# EAGLE design Servos & Aux Motors Board (EAGLE 6.5.0)
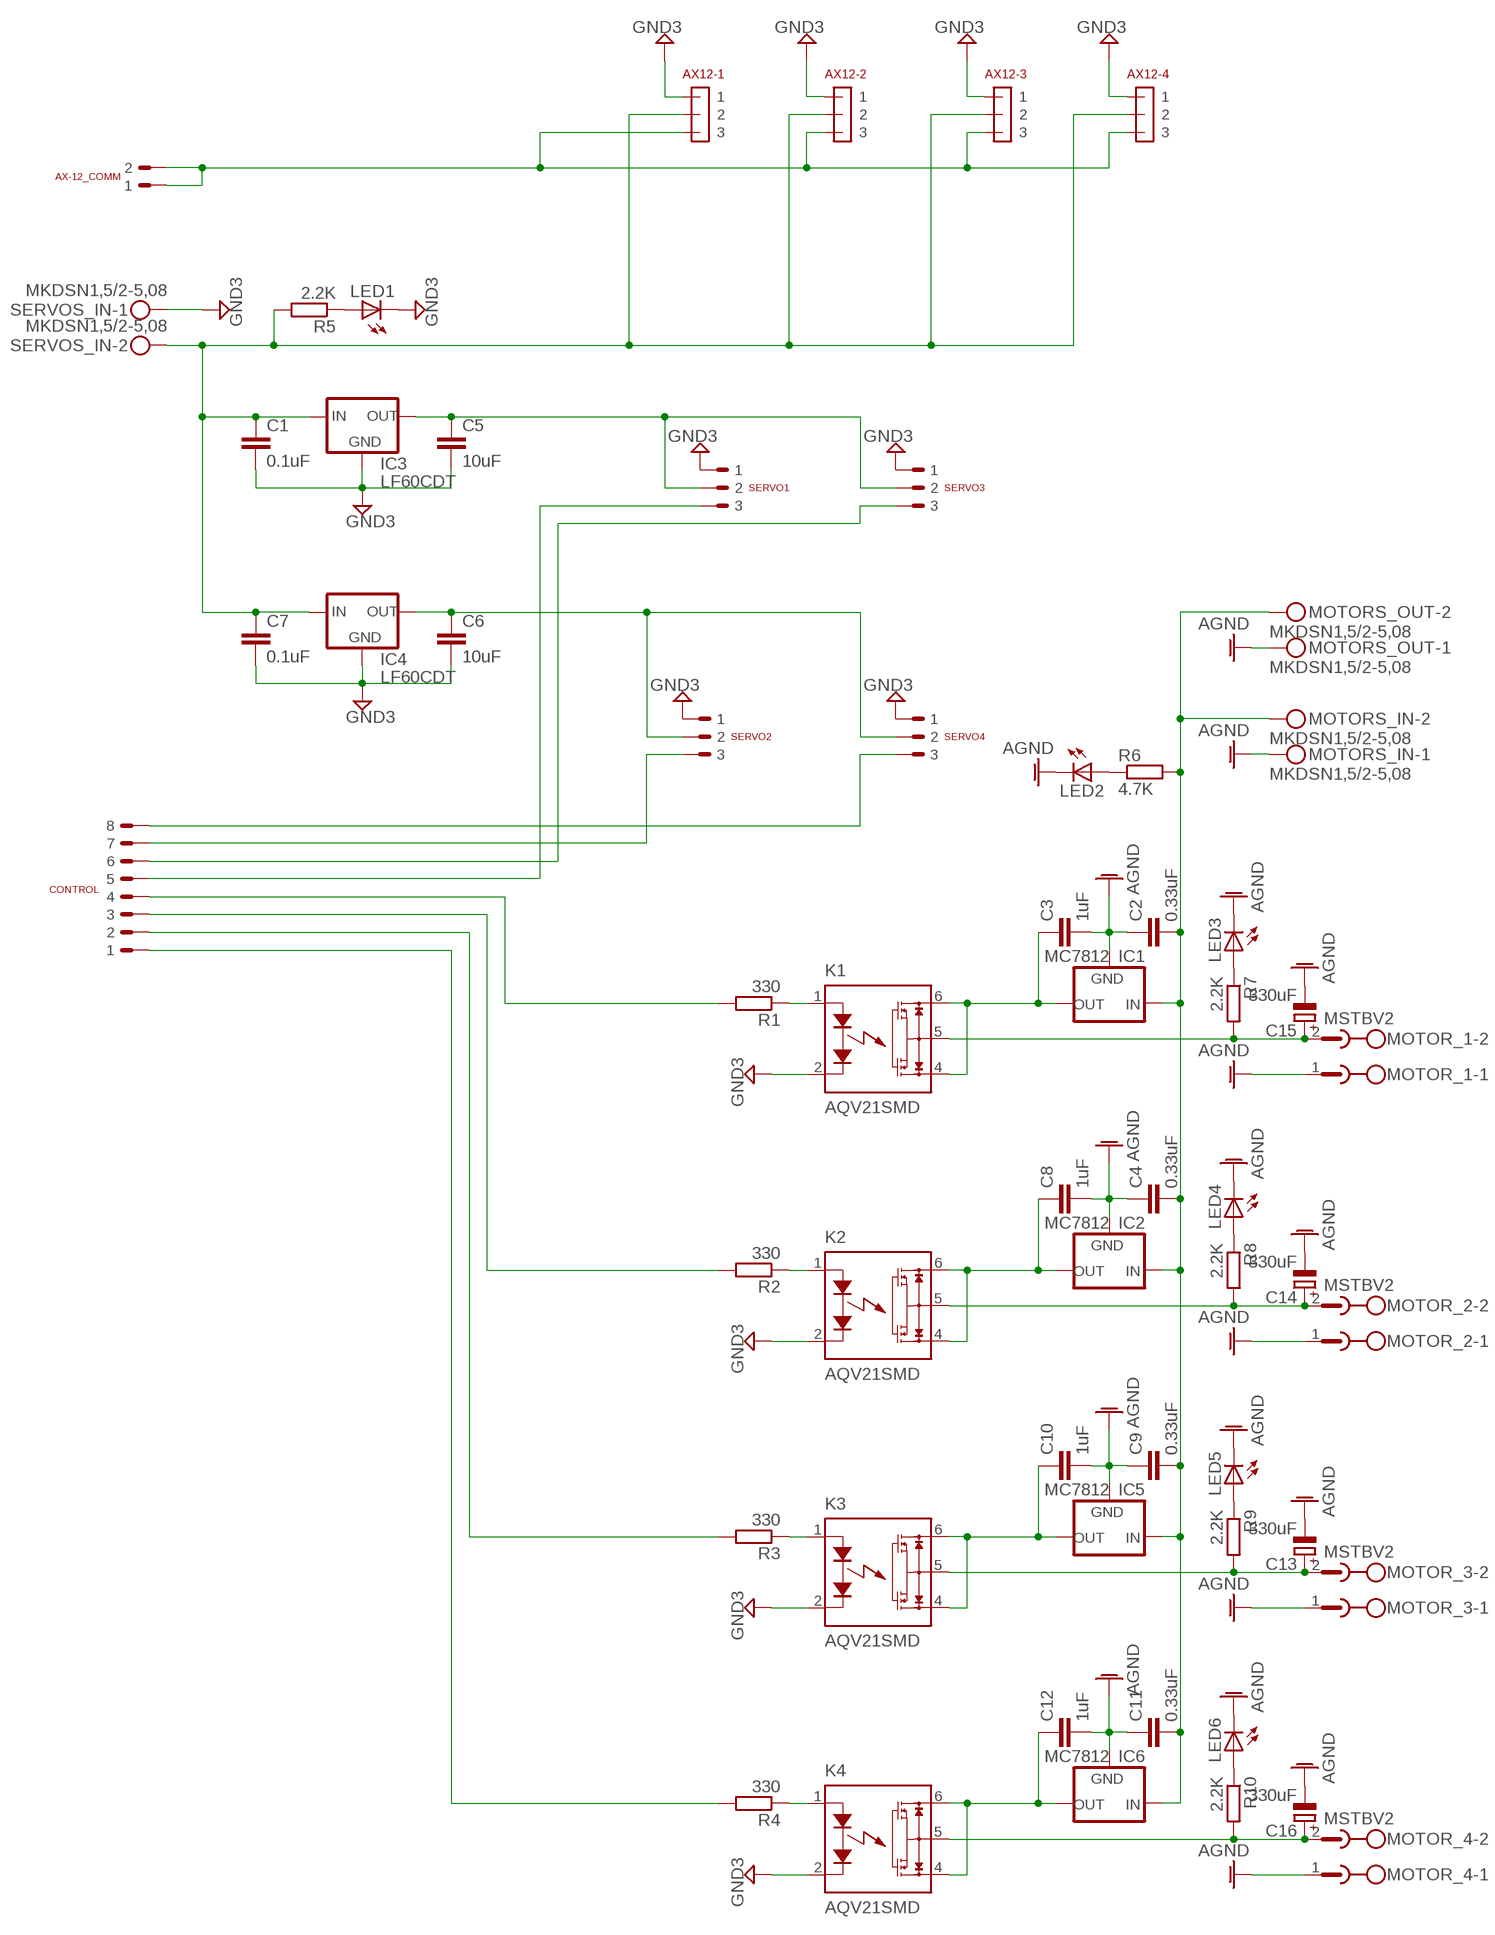
[diagram p0: schematic, sheet 1]

## Parts
AX12-1  22-03-5035  [22-03-5035]
AX12-2  22-03-5035  [22-03-5035]
AX12-3  22-03-5035  [22-03-5035]
AX12-4  22-03-5035  [22-03-5035]
AX-12_COMM  87437-0243  [87437-0243]
C1  0.1uF  C-EUC0603  [C0603]
C2  0.33uF  C-EUC0805  [C0805]
C3  1uF  C-EUC0805  [C0805]
C4  0.33uF  C-EUC0805  [C0805]
C5  10uF  C-EUC0805  [C0805]
C6  10uF  C-EUC0805  [C0805]
C7  0.1uF  C-EUC0603  [C0603]
C8  1uF  C-EUC0805  [C0805]
C9  0.33uF  C-EUC0805  [C0805]
C10  1uF  C-EUC0805  [C0805]
C11  0.33uF  C-EUC0805  [C0805]
C12  1uF  C-EUC0805  [C0805]
C13  330uF  CPOL-EUE3.5-8  [E3,5-8]
C14  330uF  CPOL-EUE3.5-8  [E3,5-8]
C15  330uF  CPOL-EUE3.5-8  [E3,5-8]
C16  330uF  CPOL-EUE3.5-8  [E3,5-8]
CONTROL  87437-0843  [87437-0843]
IC1  MC7812  LP2950CDT-5.0  [DPACK]
IC2  MC7812  LP2950CDT-5.0  [DPACK]
IC3  LF60CDT  LP2950CDT-5.0  [DPACK]
IC4  LF60CDT  LP2950CDT-5.0  [DPACK]
IC5  MC7812  LP2950CDT-5.0  [DPACK]
IC6  MC7812  LP2950CDT-5.0  [DPACK]
K1  AQV21SMD  [DIL06SMD]
K2  AQV21SMD  [DIL06SMD]
K3  AQV21SMD  [DIL06SMD]
K4  AQV21SMD  [DIL06SMD]
LED1  LEDCHIP-LED0603  [CHIP-LED0603]
LED2  LEDCHIP-LED0603  [CHIP-LED0603]
LED3  LEDCHIP-LED0603  [CHIP-LED0603]
LED4  LEDCHIP-LED0603  [CHIP-LED0603]
LED5  LEDCHIP-LED0603  [CHIP-LED0603]
LED6  LEDCHIP-LED0603  [CHIP-LED0603]
MOTOR_1  MSTBV2  [MSTBV2]
MOTOR_2  MSTBV2  [MSTBV2]
MOTOR_3  MSTBV2  [MSTBV2]
MOTOR_4  MSTBV2  [MSTBV2]
MOTORS_IN  MKDSN1,5/2-5,08  [MKDSN1,5/2-5,08]
MOTORS_OUT  MKDSN1,5/2-5,08  [MKDSN1,5/2-5,08]
R1  330  R-EU_R0603  [R0603]
R2  330  R-EU_R0603  [R0603]
R3  330  R-EU_R0603  [R0603]
R4  330  R-EU_R0603  [R0603]
R5  2.2K  R-EU_R0805  [R0805]
R6  4.7K  R-EU_R1206  [R1206]
R7  2.2K  R-EU_R0805  [R0805]
R8  2.2K  R-EU_R0805  [R0805]
R9  2.2K  R-EU_R0805  [R0805]
R10  2.2K  R-EU_R0805  [R0805]
SERVO1  87437-0343  [87437-0343]
SERVO2  87437-0343  [87437-0343]
SERVO3  87437-0343  [87437-0343]
SERVO4  87437-0343  [87437-0343]
SERVOS_IN  MKDSN1,5/2-5,08  [MKDSN1,5/2-5,08]

## Nets
24VIN: C2.2 C4.2 C9.2 C11.2 IC1.1(IN) IC2.1(IN) IC5.1(IN) IC6.1(IN) MOTORS_IN.2 MOTORS_OUT.2 R6.2
AGND: C2.1 C3.2 C4.1 C8.2 C9.1 C10.2 C11.1 C12.2 C13.- C14.- C15.- C16.- IC1.4(GND) IC2.4(GND) IC5.4(GND) IC6.4(GND) LED2.C LED3.C LED4.C LED5.C LED6.C MOTOR_1.1 MOTOR_2.1 MOTOR_3.1 MOTOR_4.1 MOTORS_IN.1 MOTORS_OUT.1
GND3: AX12-1.P$1 AX12-2.P$1 AX12-3.P$1 AX12-4.P$1 C1.2 C5.2 C6.2 C7.2 IC3.4(GND) IC4.4(GND) K1.2(K) K2.2(K) K3.2(K) K4.2(K) LED1.C SERVO1.P$1 SERVO2.P$1 SERVO3.P$1 SERVO4.P$1 SERVOS_IN.1
MOTOR1: C15.+ K1.5(S) MOTOR_1.2 R7.2
MOTOR1_CTRL: K1.1(A) R1.1
MOTOR2: C14.+ K2.5(S) MOTOR_2.2 R8.2
MOTOR2_CTRL: K2.1(A) R2.1
MOTOR3: C13.+ K3.5(S) MOTOR_3.2 R9.2
MOTOR3_CTRL: K3.1(A) R3.1
MOTOR4: C16.+ K4.5(S) MOTOR_4.2 R10.2
MOTOR4_CTRL: K4.1(A) R4.1
N$1: CONTROL.P$4 R1.2
N$2: LED1.A R5.1
N$3: C3.1 IC1.3(OUT) K1.4(D2) K1.6(D1)
N$4: LED2.A R6.1
N$5: LED3.A R7.1
N$6: LED4.A R8.1
N$7: C8.1 IC2.3(OUT) K2.4(D2) K2.6(D1)
N$8: LED5.A R9.1
N$9: CONTROL.P$3 R2.2
N$10: LED6.A R10.1
N$12: C10.1 IC5.3(OUT) K3.4(D2) K3.6(D1)
N$17: C12.1 IC6.3(OUT) K4.4(D2) K4.6(D1)
N$19: CONTROL.P$1 R4.2
N$22: CONTROL.P$2 R3.2
N$33: CONTROL.P$5 SERVO1.P$3
N$34: CONTROL.P$6 SERVO3.P$3
N$35: CONTROL.P$7 SERVO2.P$3
N$36: C6.1 IC4.3(OUT) SERVO2.P$2 SERVO4.P$2
N$37: CONTROL.P$8 SERVO4.P$3
N$39: C5.1 IC3.3(OUT) SERVO1.P$2 SERVO3.P$2
RXTX: AX12-1.P$3 AX12-2.P$3 AX12-3.P$3 AX12-4.P$3 AX-12_COMM.P$1 AX-12_COMM.P$2
SERVO_IN: AX12-1.P$2 AX12-2.P$2 AX12-3.P$2 AX12-4.P$2 C1.1 C7.1 IC3.1(IN) IC4.1(IN) R5.2 SERVOS_IN.2

## Library data of the parts
AX12-1-AX12-4 = custom:22-03-5035
AX-12_COMM = custom:87437-0243
C1-C4 C7-C12 = rcl:C-EU: CAPACITOR, European symbol
C5 C6 = resistor:C-EU: CAPACITOR, European symbol
C13-C16 = rcl:CPOL-EU: POLARIZED CAPACITOR, European symbol
CONTROL = custom:87437-0843
IC1-IC6 = v-reg:LP2950?*: Source: http://cache.national.com/ds/LP/LP2950.pdf
K1-K4 = relay:AQV*: PhotoMOS Relay NAiS Source: Data sheet <http://www.panasonic-electric-works.com/catalogues/downloads/photomos/ds_x615_en_aqv10_20.pdf>; MF: AROMAT/ MATSUSHITA; MPN: AQV210S; OC_FARNELL: unknown; OC_NEWARK: 95F6433
LED1-LED6 = led:LED: LED OSRAM: - CHIPLED LG R971, LG N971, LY N971, LG Q971, LY Q971, LO R971, LY R971 LH N974, LH R974 LS Q976, LO Q976, LY Q976 LO Q996 - Hyper CHIPLED LW Q18S LB Q993, LB Q99A, LB R99A - SideLED LS A670, LO A670, LY A670, LG A670, LP A670 LB A673, LV A673, LT A673, LW A673 LH A674 LY A675 LS A676, LA A676, LO A676, LY A676, LW A676 LS A679, LY A679, LG A679 - Hyper Micro SIDELED® LS Y876, LA Y876, LO Y876, LY Y876 LT Y87S - SmartLED LW L88C, LW L88S LB L89C, LB L89S, LG L890 LS L89K, LO L89K, LY L89K LS L896, LA L896, LO L896, LY L896 - TOPLED LS T670, LO T670, LY T670, LG T670, LP T670 LSG T670, LSP T670, LSY T670, LOP T670, LYG T670 LG T671, LOG T671, LSG T671 LB T673, LV T673, LT T673, LW T673 LH T674 LS T676, LA T676, LO T676, LY T676, LB T676, LH T676, LSB T676, LW T676 LB T67C, LV T67C, LT T67C, LS T67K, LO T67K, LY T67K, LW E67C LS E67B, LA E67B, LO E67B, LY E67B, LB E67C, LV E67C, LT E67C LW T67C LS T679, LY T679, LG T679 LS T770, LO T770, LY T770, LG T770, LP T770 LB T773, LV T773, LT T773, LW T773 LH T774 LS E675, LA E675, LY E675, LS T675 LS T776, LA T776, LO T776, LY T776, LB T776 LHGB T686 LT T68C, LB T68C - Hyper Mini TOPLED® LB M676 - Mini TOPLED Santana® LG M470 LS M47K, LO M47K, LY M47K Source: http://www.osram.convergy.de LUXEON: - LUMILED® LXK2-PW12-R00, LXK2-PW12-S00, LXK2-PW14-U00, LXK2-PW14-V00 LXK2-PM12-R00, LXK2-PM12-S00, LXK2-PM14-U00 LXK2-PE12-Q00, LXK2-PE12-R00, LXK2-PE12-S00, LXK2-PE14-T00, LXK2-PE14-U00 LXK2-PB12-K00, LXK2-PB12-L00, LXK2-PB12-M00, LXK2-PB14-N00, LXK2-PB14-P00, LXK2-PB14-Q00 LXK2-PR12-L00, LXK2-PR12-M00, LXK2-PR14-Q00, LXK2-PR14-R00 LXK2-PD12-Q00, LXK2-PD12-R00, LXK2-PD12-S00 LXK2-PH12-R00, LXK2-PH12-S00 LXK2-PL12-P00, LXK2-PL12-Q00, LXK2-PL12-R00 Source: www.luxeon.com KINGBRIGHT: KA-3528ASYC Source: www.kingbright.com
MOTOR_1-MOTOR_4 = con-phoenix-508:MSTBV2: PHOENIX; MPN: MSTBV 2,5/2-GF-5.08; OC_FARNELL: 1792792; OC_NEWARK: 69R9845
MOTORS_IN MOTORS_OUT SERVOS_IN = con-phoenix-508:MKDSN1,5/2-5,08: MKDSN 1,5/ 2-5,08 Printklemme Nennstrom: 13,5 A Nennspannung: 250 V Rastermaß: 5,08 mm Polzahl: 2 Anschlussart: Schraubanschluss Montage: Löten Anschlussrichtung Leiter/Platine: 0 ° Artikelnummer: 1729128 Source: http://eshop.phoenixcontact.com .. 1729128.pdf; MPN: MKDSN 1,5/2-5.08; OC_FARNELL: 1792903; OC_NEWARK: 30M2397
R1-R10 = rcl:R-EU_: RESISTOR, European symbol
SERVO1-SERVO4 = custom:87437-0343

## Board
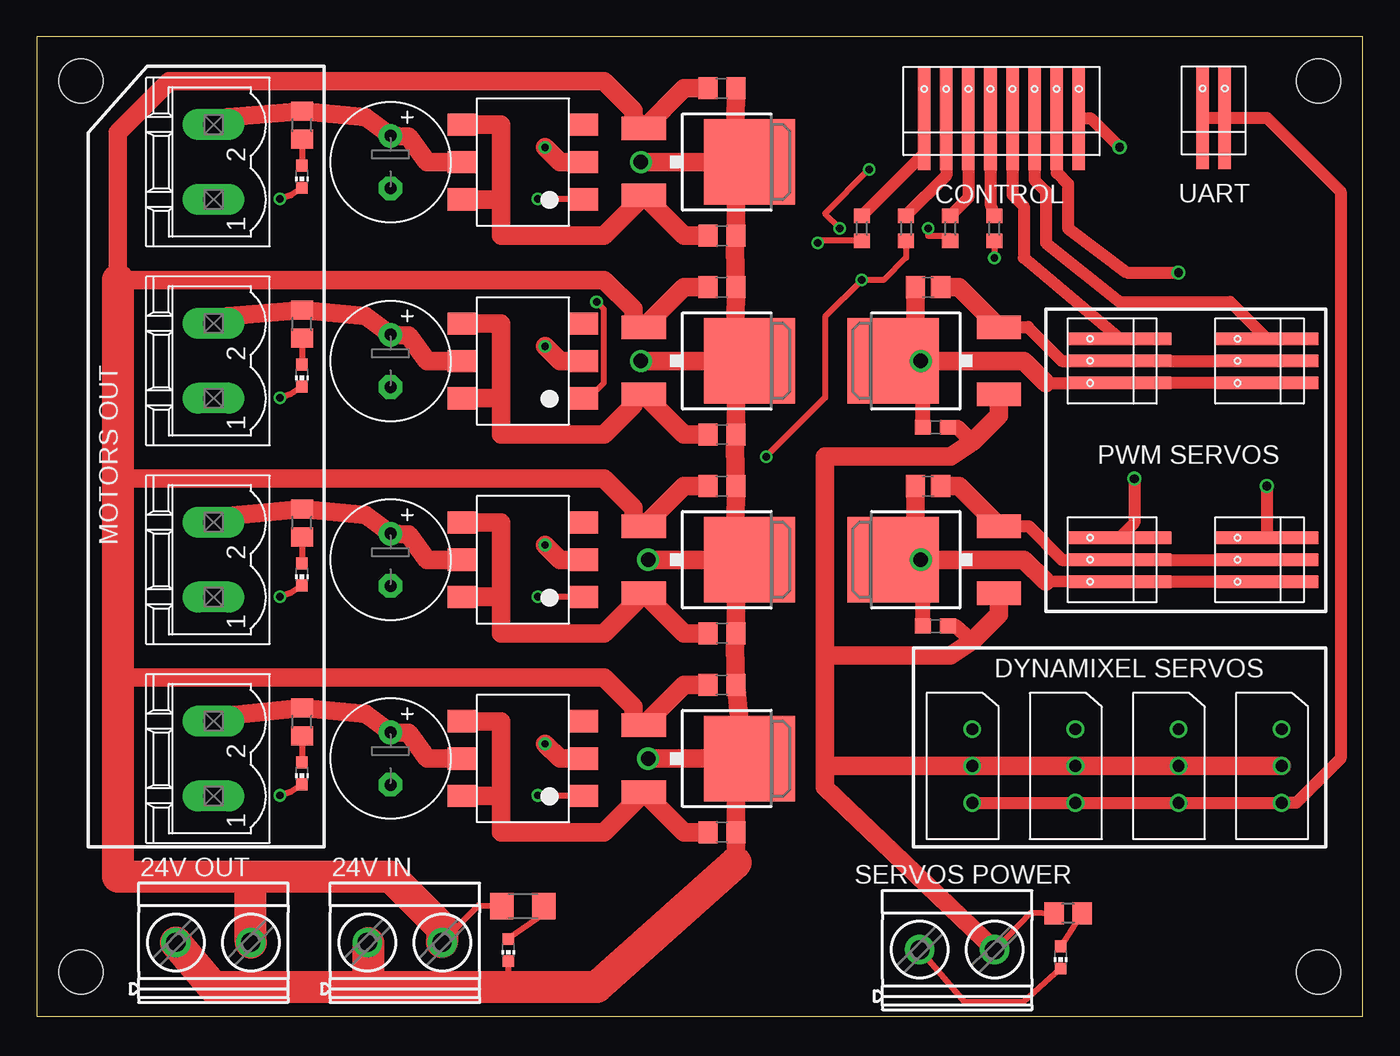
[diagram p1: board, top side]
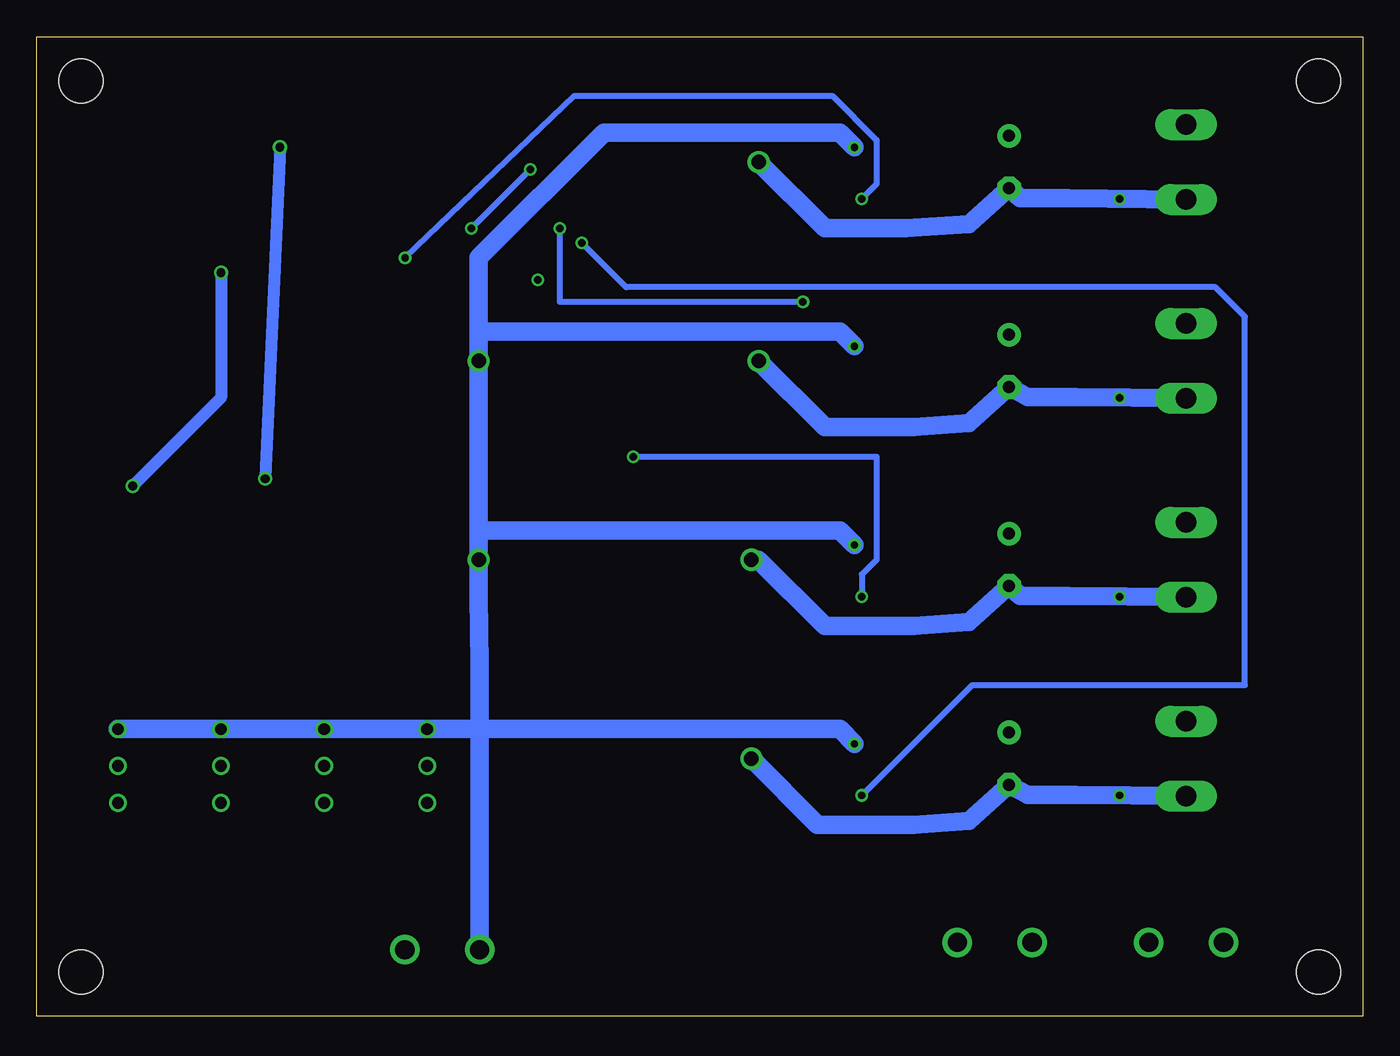
[diagram p2: board, bottom side, seen from below]

Size 90 x 66.5 mm. Coordinates in mm from the lower left corner, seen from the top.
Outline: 0,0 90,0 90,66.5 0,66.5 0,0
Copper layers (1*16): Top 0.0356mm / dielectric 1.5011mm / Bottom 0.0356mm
Design rules "LaenPCBOrder": minimum track width 6mil, minimum drill 13mil, track to track 6mil, track to pad 6mil, pad to pad 6mil, via to via 6mil, smd to smd 6mil, copper to edge 15mil, drill to drill 6mil, minimum pad ring 7mil, minimum via ring 7mil, stop-mask expansion 4mil, vias tented up to drill 0mil, thermal gap 10mil
Holes 3 mm at 87,3 87,63.5 3,63.5 3,3

### Footprints (pad centres in the part's own frame; a part is rotated, then mirrored left to right if it is on the bottom)
22-03-5035 = drill 0.8: P$1 -2.5,0; P$2 0,0; P$3 2.5,0
87437-0243 = smd 7 x 0.85: P$1 0,0.865; P$2 0,-0.635
C0603 = smd 1.1 x 1: 1 -0.85,0; 2 0.85,0
C0805 = smd 1.3 x 1.5: 1 -0.95,0; 2 0.95,0
C0805' = smd 1.3 x 1.5: 1 -0.85,0; 2 0.85,0
E3,5-8 = drill 0.813 pad 1.6: + -1.778,0 | drill 0.813 pad 1.6 octagon: - 1.778,0
87437-0843 = smd 7 x 0.85: P$1 -0.04,5.27; P$2 -0.04,3.77; P$3 -0.04,2.27; P$4 -0.04,0.77; P$5 -0.04,-0.73; P$6 -0.04,-2.23; P$7 -0.04,-3.73; P$8 -0.04,-5.23
DPACK = smd 1.6 x 3: 1 -2.28,-4.8; 3 2.28,-4.8 | smd 5.8 x 6.2: 4 0,2.38
DIL06SMD = smd 1.5 x 1.9: 1 -2.54,-4.15; 2 0,-4.15; 3 2.54,-4.15; 4 2.54,4.15; 5 0,4.15; 6 -2.54,4.15
CHIP-LED0603 = smd 0.8 x 0.8: A 0,-0.75; C 0,0.75
MSTBV2 = drill 1.397 long: 1 -2.54,0; 2 2.54,0
MKDSN1,5/2-5,08 = drill 1.3 pad 2: 1 -2.561,0.025; 2 2.519,0.025
R0603 = smd 1 x 1.1: 1 -0.85,0; 2 0.85,0
R0805 = smd 1.3 x 1.5: 1 -0.95,0; 2 0.95,0
R1206 = smd 1.6 x 1.803: 1 -1.422,0; 2 1.422,0
87437-0343 = smd 7 x 0.85: P$1 0,1.5; P$2 0,0; P$3 0,-1.5

### Placement (x,y rotation side)
AX12-1  84.5,17 270 top
AX12-2  77.5,17 270 top
AX12-3  70.5,17 270 top
AX12-4  63.5,17 270 top
AX-12_COMM  80,61 90 top
C1  61,40 180 top
C2  46.5,63 180 top
C3  46.5,53 0 top
C4  46.5,49.5 180 top
C5  10uF  [C0805']  60.5,49.5 180 top
C6  10uF  [C0805']  60.5,36 180 top
C7  61,26.5 180 top
C8  46.5,39.5 0 top
C9  46.5,36 180 top
C10  46.5,26 0 top
C11  46.5,22.5 180 top
C12  46.5,12.5 0 top
C13  24,31 270 top
C14  24,44.5 270 top
C15  24,58 270 top
C16  24,17.5 270 top
CONTROL  65.5,61 90 top
IC1  46,58 270 top
IC2  46,44.5 270 top
IC3  60.5,44.5 90 top
IC4  60.5,31 90 top
IC5  46,31 270 top
IC6  46,17.5 270 top
K1  33,58 90 top
K2  33,44.5 90 top
K3  33,31 90 top
K4  33,17.5 90 top
LED1  69.5,4 180 top
LED2  32,4.5 180 top
LED3  18,57 180 top
LED4  18,43.5 180 top
LED5  18,30 180 top
LED6  18,16.5 180 top
MOTOR_1  12,58 90 top
MOTOR_2  12,44.5 90 top
MOTOR_3  12,31 90 top
MOTOR_4  12,17.5 90 top
MOTORS_IN  25,5 0 top
MOTORS_OUT  12,5 0 top
R1  65,53.5 90 top
R2  62,53.5 90 top
R3  59,53.5 90 top
R4  56,53.5 90 top
R5  70,7 180 top
R6  33,7.5 180 top
R7  18,60.5 90 top
R8  18,47 90 top
R9  18,33.5 90 top
R10  18,20 90 top
SERVO1  73.5,44.5 180 top
SERVO2  83.5,31 180 top
SERVO3  83.5,44.5 180 top
SERVO4  73.5,31 180 top
SERVOS_IN  62.5,4.5 0 top

### Tracks (layer width: path | path; a pad name or v marks a point on that pad's centre or on a via)
24VIN
  Top 0.406: MOTORS_IN.2 29.99,7.55 R6.2
  Top 1.27: C2.2 43.92,63 IC1.1 40.5,60.98 40.5,61.5 38.5,63.5 9,63.5 5.5,60 5.5,50 38.5,50 40.5,48 40.5,47.48 IC2.1 43.92,49.5 C4.2 | 27.5,5.04 MOTORS_IN.2 | 14.52,8.98 14.5,9.5 | C9.2 43.92,36 IC5.1 40.5,33.98 40.5,34.5 38.5,36.5 5.5,36.5 | C11.2 43.92,22.5 IC6.1 40.72,19.78 40.5,20 40.5,21 38.5,23 5.5,23
  Top 2.184: 5.5,50 5.5,36.5 5.5,23 5.5,9.5 14.5,9.5 24,9.5 27.5,6 27.5,5.04 | MOTORS_OUT.2 14.52,8.98
AGND  (via drill 0.5, 1)
  Top 0.406: LED2.C 32,2 | LED3.C 17.25,55.75 v16.5,55.5 | LED4.C 17.25,42.25 v16.5,42 | LED5.C 17.25,28.75 v16.5,28.5 | LED6.C 17.25,15.25 v16.5,15
  Top 1.27: C2.1 47.4,57.98 IC1.4 | IC1.4 47.45,56.57 C3.2 47.4,52.05 C4.1 47.4,44.48 IC2.4 | IC2.4 47.45,43.57 C8.2 47.4,38.55 C9.1 47.4,30.48 IC5.4 | 47.45,16.07 C12.2 47.45,10.45 | 47.45,16.07 IC6.4 47.9,17.98 C11.1 47.4,25.05 C10.2 47.45,29.57 IC5.4 | MOTORS_IN.1 22.5,4.96 | 47.45,16.07 45.52,17.5 v41.5,17.5 | v41.5,31 IC5.4 | v41,44.5 IC2.4 | v41,58 IC1.4
  Top 2.184: MOTORS_OUT.1 11.96,2 22.5,2 | 22.5,2 32,2 38,2 47.45,10.45 | 22.5,4.96 22.5,2
  Bottom 0.406: v16.5,55.5 20,55.54 | v16.5,42 19.5,42.04 | v16.5,28.5 20,28.54 | v16.5,15 19.5,15.04
  Bottom 1.27: v41.5,17.5 37,13 30.5,13 26.73,13.27 C16.- 22.73,15.04 19.5,15.04 MOTOR_4.1 | MOTOR_3.1 20,28.54 23.23,28.54 C13.- 26.73,26.77 30.5,26.5 36.5,26.5 41,31 v41.5,31 | MOTOR_2.1 19.5,42.04 22.73,42.04 C14.- 26.73,40.27 30.5,40 36.5,40 v41,44.5 | MOTOR_1.1 20,55.54 23.23,55.54 C15.- 26.73,53.77 31,53.5 36.5,53.5 v41,58
GND3  (via drill 0.5, 1)
  Top 0.406: LED1.C 67,1 62.96,1 SERVOS_IN.1
  Top 0.813: SERVO3.P$1 SERVO1.P$1 68.5,43 | SERVO2.P$1 SERVO4.P$1 70,29.5 68.49,29.51
  Top 1.016: C7.2 60.15,28.97 IC4.4 | C1.2 60.15,42.97 IC3.4
  Top 1.27: C6.2 59.65,32.53 | 59.65,32.53 IC4.4 v60,31 | C5.2 59.65,45.03 IC3.4 v60,44.5 67,44.5 68.5,43 | 68.49,29.51 67,31 v60,31 | K4.2 35.5,17.5 v34.5,18.5 | K3.2 35.5,31 v34.5,32 | K2.2 35.5,44.5 v34.5,45.5 | K1.2 35.5,58 v34.5,59 | 60.15,28.97 60,29.12 v60,31 | 59.65,32.53 60,32.18 v60,31
  Bottom 1.27: AX12-1.P$1 AX12-2.P$1 AX12-3.P$1 AX12-4.P$1 59.94,19.5 | SERVOS_IN.1 59.94,19.5 | 59.94,19.5 59.94,23.94 60,28.5 60,29.5 | 60,33 v60,44.5 60,46.5 | 60.01,29.51 60,29.5 | v34.5,18.5 35.5,19.5 59.94,19.5 | v34.5,32 35.5,33 60,33 | v34.5,45.5 35.5,46.5 60,46.5 | v34.5,59 35.5,60 51.5,60 60,51.5 60,46.5 | 60,29.5 v60,31 60,33
MOTOR1
  Top 1.27: MOTOR_1.2 13,61.05 R7.2 22.32,61.05 C15.+ 25.23,59.73 26.5,58 K1.5
MOTOR1_CTRL  (via drill 0.5)
  Top 0.406: R1.1 v65,51.5 | v34,55.5 37.11,55.5 K1.1
  Bottom 0.406: v65,51.5 53.5,62.5 36,62.5 33,59.5 33,56.5 v34,55.5
MOTOR2
  Top 1.27: MOTOR_2.2 13,47.55 R8.2 22.32,47.55 C14.+ 25.23,46.23 26.5,44.5 K2.5
MOTOR2_CTRL  (via drill 0.51)
  Top 0.406: v60.5,53.5 60.5,53 62,53 R2.1 | v56.5,57.5 53.5,54.5 v54.5,53.5 | v38,48.5 38.5,48 38.5,43 37.5,42 K2.1
  Bottom 0.406: v56.5,57.5 v60.5,53.5 | v54.5,53.5 54.5,48.5 v38,48.5
MOTOR3
  Top 1.27: MOTOR_3.2 12.91,33.96 R9.2 22.32,34.05 C13.+ 25.23,32.73 26.5,31 K3.5
MOTOR3_CTRL  (via drill 0.5)
  Top 0.406: R3.1 59,51.5 57.5,50 v56,50 53.5,47.5 53.5,42 v49.5,38 | v34,28.5 37.11,28.5 K3.1
  Bottom 0.406: v34,28.5 34,30 33,31 33,38 v49.5,38
MOTOR4
  Top 1.27: MOTOR_4.2 13.41,20.46 R10.2 22.32,20.55 C16.+ 25.23,19.23 26.5,17.5 K4.5
MOTOR4_CTRL  (via drill 0.5)
  Top 0.406: R4.1 53.15,52.65 v53,52.5 | v34,15 37.11,15 K4.1
  Bottom 0.406: v53,52.5 50,49.5 10,49.5 8,47.5 8,22.5 26.5,22.5 v34,15
N$1
  Top 0.813: CONTROL.P$4 64.73,55.12 R1.2
N$2
  Top 0.406: R5.1 LED1.A
N$3
  Top 1.27: K1.4 31.5,60.54 31.5,55.46 | 31.5,55.46 K1.6 | 31.5,55.46 31.5,53 38.5,53 IC1.3 43.92,53 C3.1
N$4
  Top 0.406: R6.1 34.5,7 LED2.A
N$5
  Top 0.406: R7.1 LED3.A
N$6
  Top 0.406: R8.1 LED4.A
N$7
  Top 1.27: C8.1 43.92,39.5 IC2.3 40.72,42.22 40.5,42 40.5,41.5 38.5,39.5 31.5,39.5 31.5,41.96 | K2.6 31.5,41.96 | 31.5,41.96 31.5,47.04 K2.4
N$8
  Top 0.406: R9.1 LED5.A
N$9
  Top 0.813: CONTROL.P$3 63.23,55.58 R2.2
N$10
  Top 0.406: R10.1 LED6.A
N$12
  Top 1.27: K3.4 31.5,33.54 31.5,28.5 28.85,28.5 K3.6 31.5,28.46 31.5,26 38.5,26 41.2,28.7 IC5.3 43.92,26 C10.1
N$17
  Top 1.27: K4.4 31.5,20.04 31.5,14.96 | K4.6 31.5,14.96 | 31.5,14.96 31.5,12.5 38.5,12.5 41.2,15.2 IC6.3 43.92,12.5 C12.1
N$19
  Top 0.813: CONTROL.P$1 60.23,58.58 R4.2
N$22
  Top 0.813: CONTROL.P$2 61.73,57.08 R3.2
N$33
  Top 0.813: CONTROL.P$5 66.23,55.77 67,55 67,51.5 SERVO1.P$3
N$34
  Top 0.813: CONTROL.P$6 67.73,56.77 68.5,56 68.5,52.5 73.5,48.5 81,48.5 SERVO3.P$3
N$35  (via drill 0.6)
  Top 0.813: CONTROL.P$7 69.23,57.27 70,56.5 70,53.5 74,50.5 v77.5,50.5 | v83.5,36 SERVO2.P$3
  Bottom 0.813: v77.5,50.5 77.5,42 v83.5,36
N$36
  Top 0.813: SERVO2.P$2 SERVO4.P$2 69.58,31 67.32,33.27 IC4.3
  Top 1.27: IC4.3 62.58,36 C6.1
N$37  (via drill 0.6)
  Top 0.813: CONTROL.P$8 71.54,60.96 v73.5,59 | v74.5,36.5 74.5,33.5 SERVO4.P$3
  Bottom 0.813: v73.5,59 v74.5,36.5
N$39
  Top 0.813: IC3.3 67.28,46.8 69.58,44.5 SERVO1.P$2 SERVO3.P$2
  Top 1.27: IC3.3 62.58,49.5 C5.1
RXTX
  Top 0.813: AX12-4.P$3 AX12-3.P$3 AX12-2.P$3 AX12-1.P$3 85.5,14.5 88.5,17.5 88.5,56 83.5,61 AX-12_COMM.P$1 AX-12_COMM.P$2
SERVO_IN
  Top 0.406: SERVOS_IN.2 67.49,7.05 R5.2
  Top 1.016: C7.1 62.35,26.5 63.5,25.5 | C1.1 62.5,40 63.5,39
  Top 1.27: SERVOS_IN.2 53.5,15.54 53.5,17 | 53.5,17 53.5,24.5 | 53.5,24.5 62,24.5 63.5,25.5 65.3,27.3 IC4.1 | IC3.1 65.3,40.8 63.5,39 62,38 53.5,38 53.5,24.5 | AX12-1.P$2 AX12-2.P$2 AX12-3.P$2 AX12-4.P$2 53.5,17

### Text on the board
tNames: UART | PWM SERVOS | MOTORS OUT | DYNAMIXEL SERVOS | 24V OUT | 24V IN | SERVOS POWER